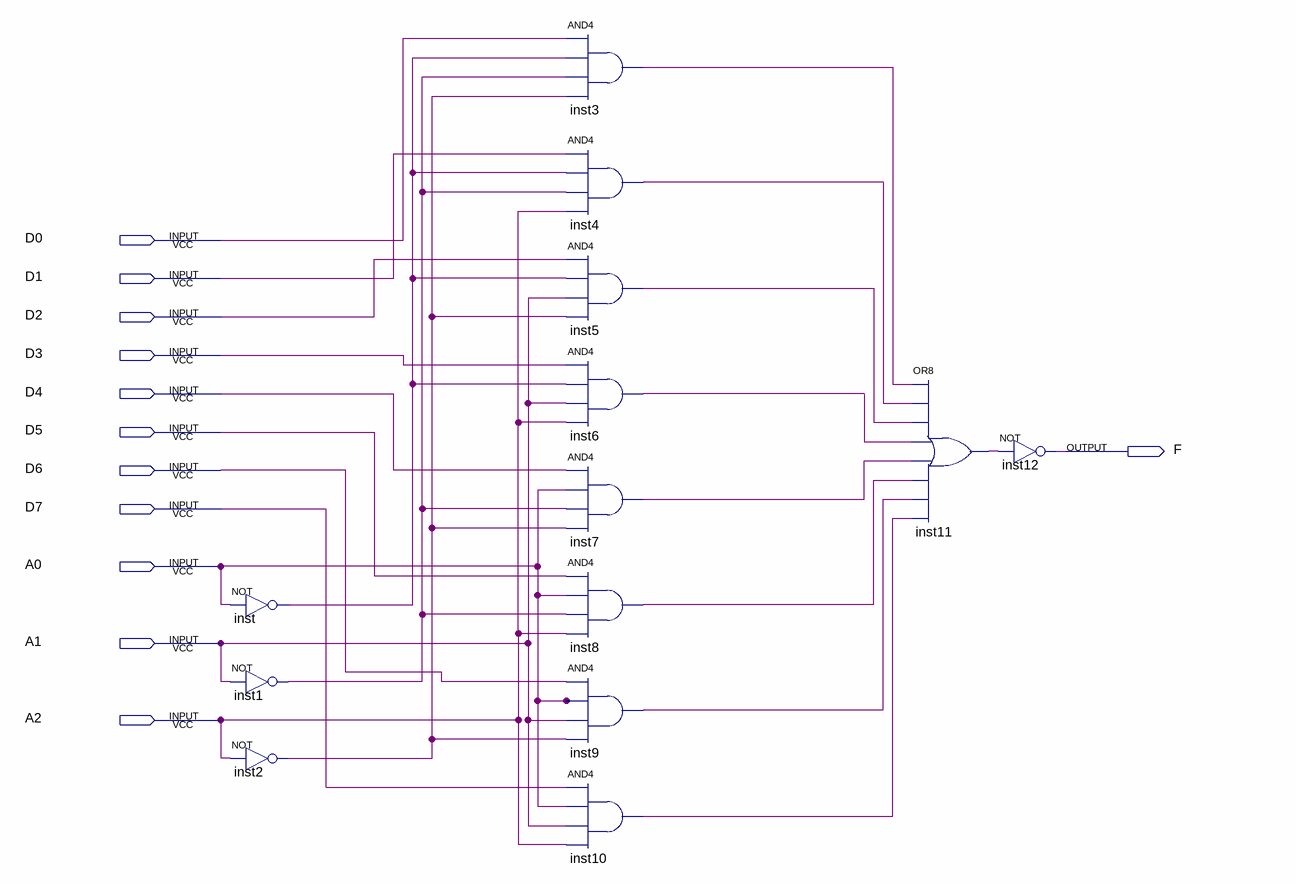
[diagram p0: schematic sheet]
// Quartus schematic lab21.bdf as structural Verilog: 13 symbols, 12 pins
module lab21 (
  input  D0,
  input  D1,
  input  D2,
  input  D3,
  input  D4,
  input  D5,
  input  D6,
  input  D7,
  input  A0,
  input  A1,
  input  A2,
  output F
);

  wire inst1_out, inst2_out, inst3_out, inst4_out, inst5_out, inst6_out, inst7_out, inst8_out, inst9_out,
       inst10_out, inst11_out, inst_out;

  not inst (inst_out, A0);
  not inst1 (inst1_out, A1);
  not inst2 (inst2_out, A2);
  and inst3 (inst3_out, D0, inst_out, inst1_out, inst2_out);
  and inst4 (inst4_out, D1, inst_out, inst1_out, A2);
  and inst5 (inst5_out, D2, inst_out, A1, inst2_out);
  and inst6 (inst6_out, D3, inst_out, A1, A2);
  and inst7 (inst7_out, D4, A0, inst1_out, inst2_out);
  and inst8 (inst8_out, D5, A0, inst1_out, A2);
  and inst9 (inst9_out, D6, A0, A1, inst2_out);
  and inst10 (inst10_out, D7, A0, A1, A2);
  or inst11 (inst11_out, inst3_out, inst4_out, inst5_out, inst6_out, inst7_out, inst8_out, inst9_out, inst10_out);
  not inst12 (F, inst11_out);
endmodule
